# EAGLE design STM32_MACH3-Interfaceboard_V2 (EAGLE 7.7.0)
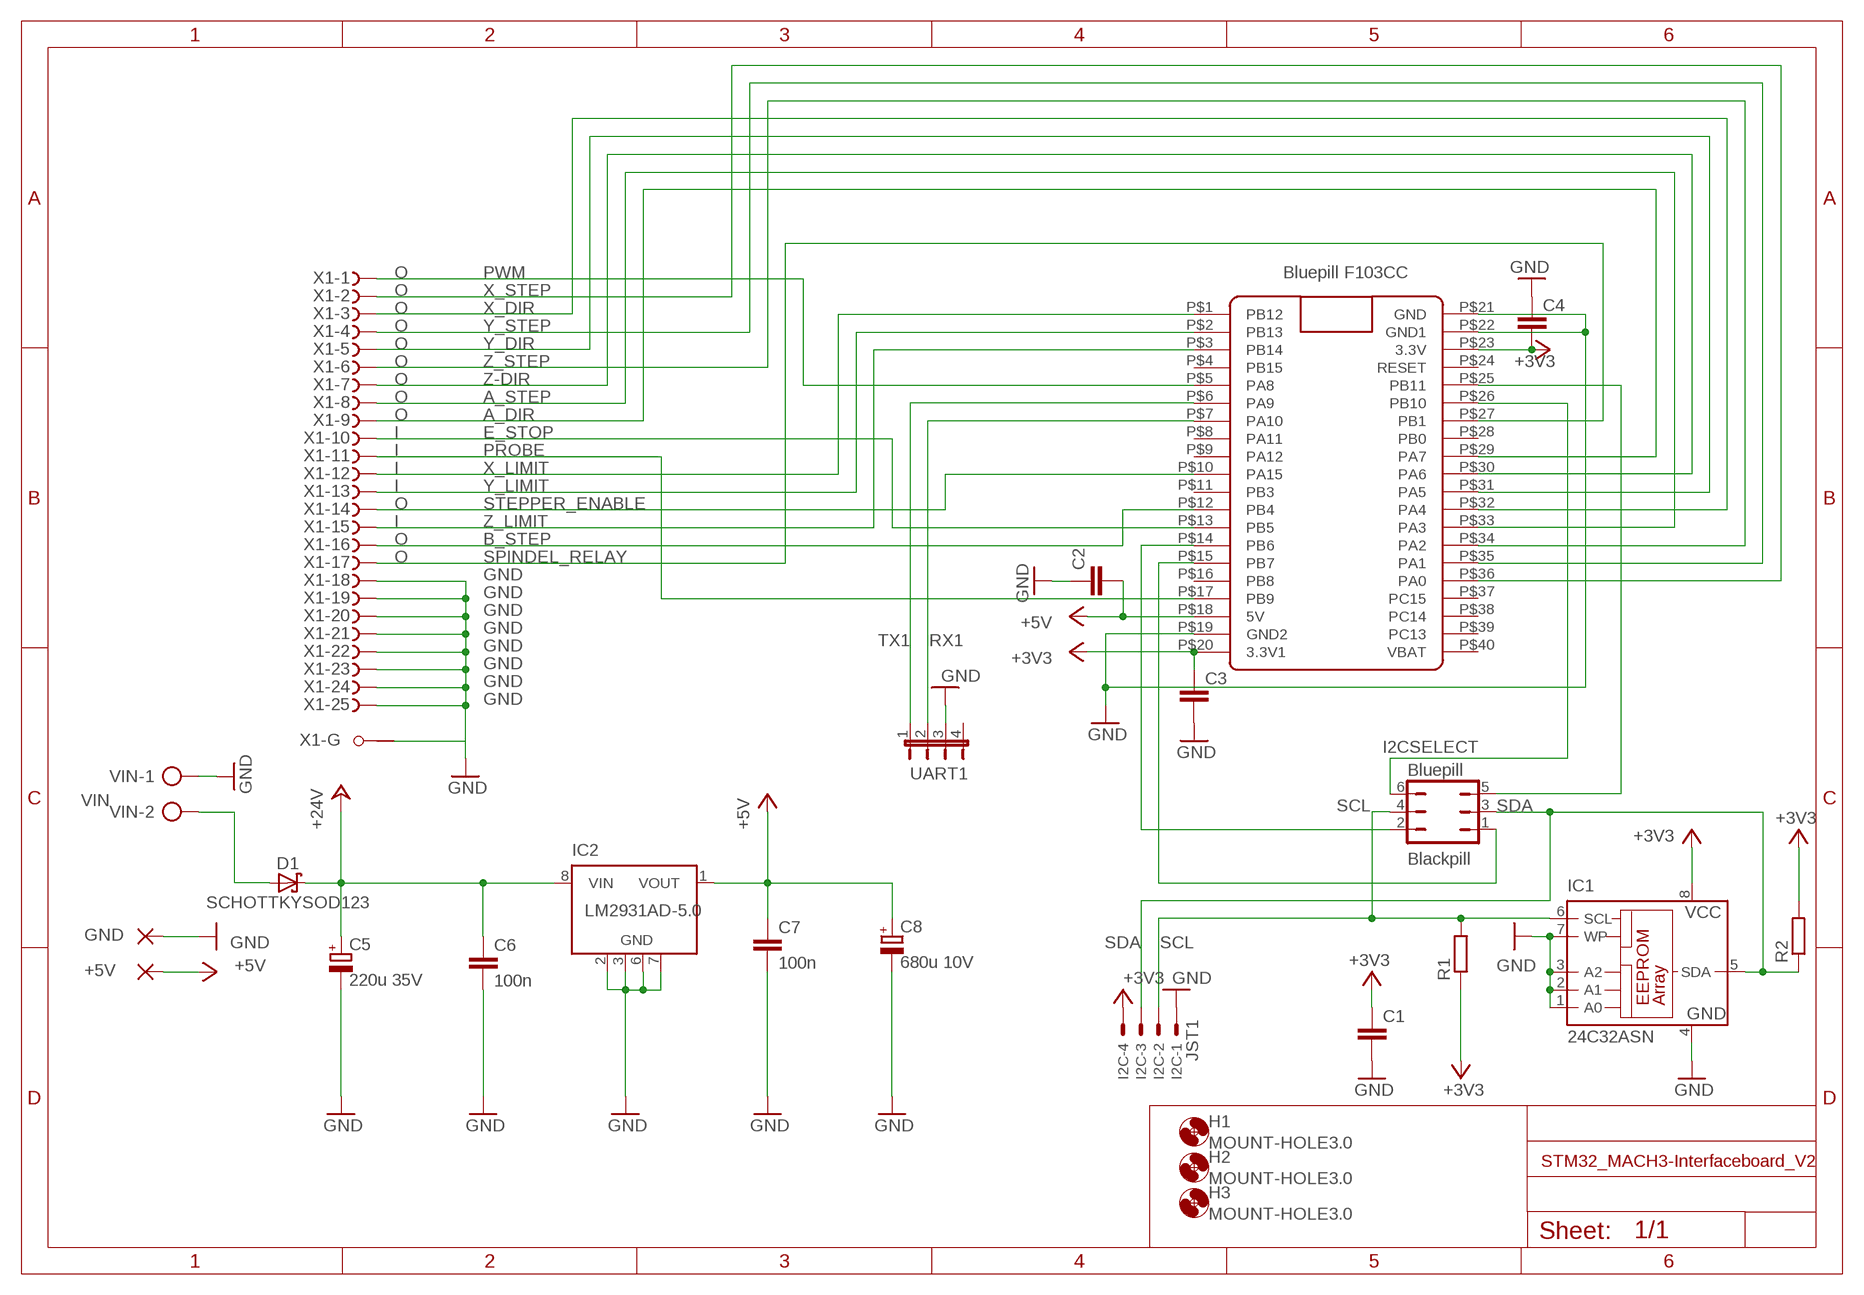
[diagram p0: schematic, sheet 1]

## Parts
+5V  2,54/1,0  [2,54/1,0]
C1  C-EUC0805  [C0805]
C2  C-EUC0805  [C0805]
C3  C-EUC0805  [C0805]
C4  C-EUC0805  [C0805]
C5  220u 35V  C_POLARIZEDE7  [PANASONIC_E7]
C6  100n  CC0805  [C0805]
C7  100n  CC0805  [C0805]
C8  680u 10V  C_POLARIZEDE7  [PANASONIC_E7]
D1  SCHOTTKYSOD123  [SOD123]
GND  2,54/1,0  [2,54/1,0]
H1  MOUNT-HOLE3.0  [3,0]
H2  MOUNT-HOLE3.0  [3,0]
H3  MOUNT-HOLE3.0  [3,0]
I2C  JST1  JST-XH-04-PIN-LONG-PAD  [JST-XH-04-PACKAGE-LONG-PAD]
I2CSELECT  JP3Q  [JP3Q]
IC1  24C32ASN  [SO-08]
IC2  LM2931AD-5.0  [SOIC8]
R1  R-EU_R0805  [R0805]
R2  R-EU_R0805  [R0805]
U$1  BLUE_PILL  [BLUE_PILL]
UART1  JP4E  [JP4]
VIN  AK500/2  [AK500/2]
X1  F25HPS  [F25HP]

## Nets
+3V3: C1.1 C3.1 C4.2 I2C.4 IC1.8(VCC) R1.1 R2.2 U$1.P$20(3.3V1) U$1.P$23(3.3V)
+5V: +5V.1(P) C2.2 C7.1 C8.+ IC2.1(VOUT) U$1.P$18(5V)
+24V: C5.+ C6.1 D1.C IC2.8(VIN)
A_DIR: U$1.P$29(PA7) X1.9(-9:F)
A_STEP: U$1.P$33(PA3) X1.8(-8:F)
B_STEP: U$1.P$12(PB4) X1.16(-16:F)
E_STOP: U$1.P$13(PB5) X1.10(-10:F)
GND: C1.2 C2.1 C3.2 C4.1 C5.- C6.2 C7.2 C8.- GND.1(P) I2C.1 IC1.1(A0) IC1.2(A1) IC1.3(A2) IC1.4(GND) IC1.7(WP) IC2.2(GND) IC2.3(GND) IC2.6(GND) IC2.7(GND) U$1.P$19(GND2) U$1.P$21(GND) U$1.P$22(GND1) UART1.3 VIN.1 X1.18(-18:F) X1.19(-19:F) X1.20(-20:F) X1.21(-21:F) X1.22(-22:F) X1.23(-23:F) X1.24(-24:F) X1.25(-25:F) X1.G1(-G:G1)
N$1: I2CSELECT.5 U$1.P$25(PB11)
N$2: I2CSELECT.6 U$1.P$26(PB10)
N$3: I2CSELECT.2 U$1.P$14(PB6)
N$4: I2CSELECT.1 U$1.P$15(PB7)
PROBE: U$1.P$17(PB9) X1.11(-11:F)
PWM: U$1.P$5(PA8) X1.1(-1:F)
RX1: U$1.P$7(PA10) UART1.2
SCL: I2C.2 I2CSELECT.4 IC1.6(SCL) R1.2
SDA: I2C.3 I2CSELECT.3 IC1.5(SDA) R2.1
SPINDEL_RELAY: U$1.P$27(PB1) X1.17(-17:F)
STEPPER_ENABLE: U$1.P$10(PA15) X1.14(-14:F)
TX1: U$1.P$6(PA9) UART1.1
VIN: D1.A VIN.2
X_DIR: U$1.P$32(PA4) X1.3(-3:F)
X_LIMIT: U$1.P$1(PB12) X1.12(-12:F)
X_STEP: U$1.P$36(PA0) X1.2(-2:F)
Y_DIR: U$1.P$31(PA5) X1.5(-5:F)
Y_LIMIT: U$1.P$2(PB13) X1.13(-13:F)
Y_STEP: U$1.P$35(PA1) X1.4(-4:F)
Z-DIR: U$1.P$30(PA6) X1.7(-7:F)
Z_LIMIT: U$1.P$3(PB14) X1.15(-15:F)
Z_STEP: U$1.P$34(PA2) X1.6(-6:F)
Unconnected: U$1.P$4(PB15) U$1.P$8(PA11) U$1.P$9(PA12) U$1.P$11(PB3) U$1.P$16(PB8) U$1.P$24(RESET) U$1.P$28(PB0) U$1.P$37(PC15) U$1.P$38(PC14) U$1.P$39(PC13) U$1.P$40(VBAT) UART1.4 X1.G2(-G:G2)

## Notes on the sheet
- O | Bluepill F103CC
- O
- O
- O
- O
- O
- O
- O
- O
- I
- I
- I
- I
- O
- I
- O
- O
- Bluepill
- Blackpill

## Library data of the parts
+5V GND = wirepad:2,54/1,0: THROUGH-HOLE PAD
C1-C4 = rcl:C-EU: CAPACITOR, European symbol
C5 C8 = 00Capacitor:C_POLARIZED
C6 C7 = 00Capacitor:C: Capacitor
D1 = 00Diode:SCHOTTKY
H1-H3 = holes:MOUNT-HOLE: MOUNTING HOLE with drill center marker
I2C = JST XH Connectors v1-0:JST-XH-04-PIN: JST XH Connector 2 Pin Wire to board connector. Pitch: 2,54 mm, (0.100") Number of pins: 4 Created by Rembrandt Electronics www.rembrandtelectronics.com
I2CSELECT = jumper:JP3Q: JUMPER
IC1 = microchip:24*: Serial EEPROM I2C; MPN: IS24C32A-2GLI; OC_FARNELL: 1224413; OC_NEWARK: 43M4588
IC2 = 00VoltageRegulator:LM2931*
R1 R2 = rcl:R-EU_: RESISTOR, European symbol
U$1 = BluePill:BLUE_PILL
UART1 = jumper:JP4E: JUMPER
VIN = con-ptr500:AK500/2: CONNECTOR; OC_FARNELL: unknown; OC_NEWARK: unknown
X1 = con-subd:F25HPS: SUB-D; OC_FARNELL: unknown; OC_NEWARK: unknown

## Board
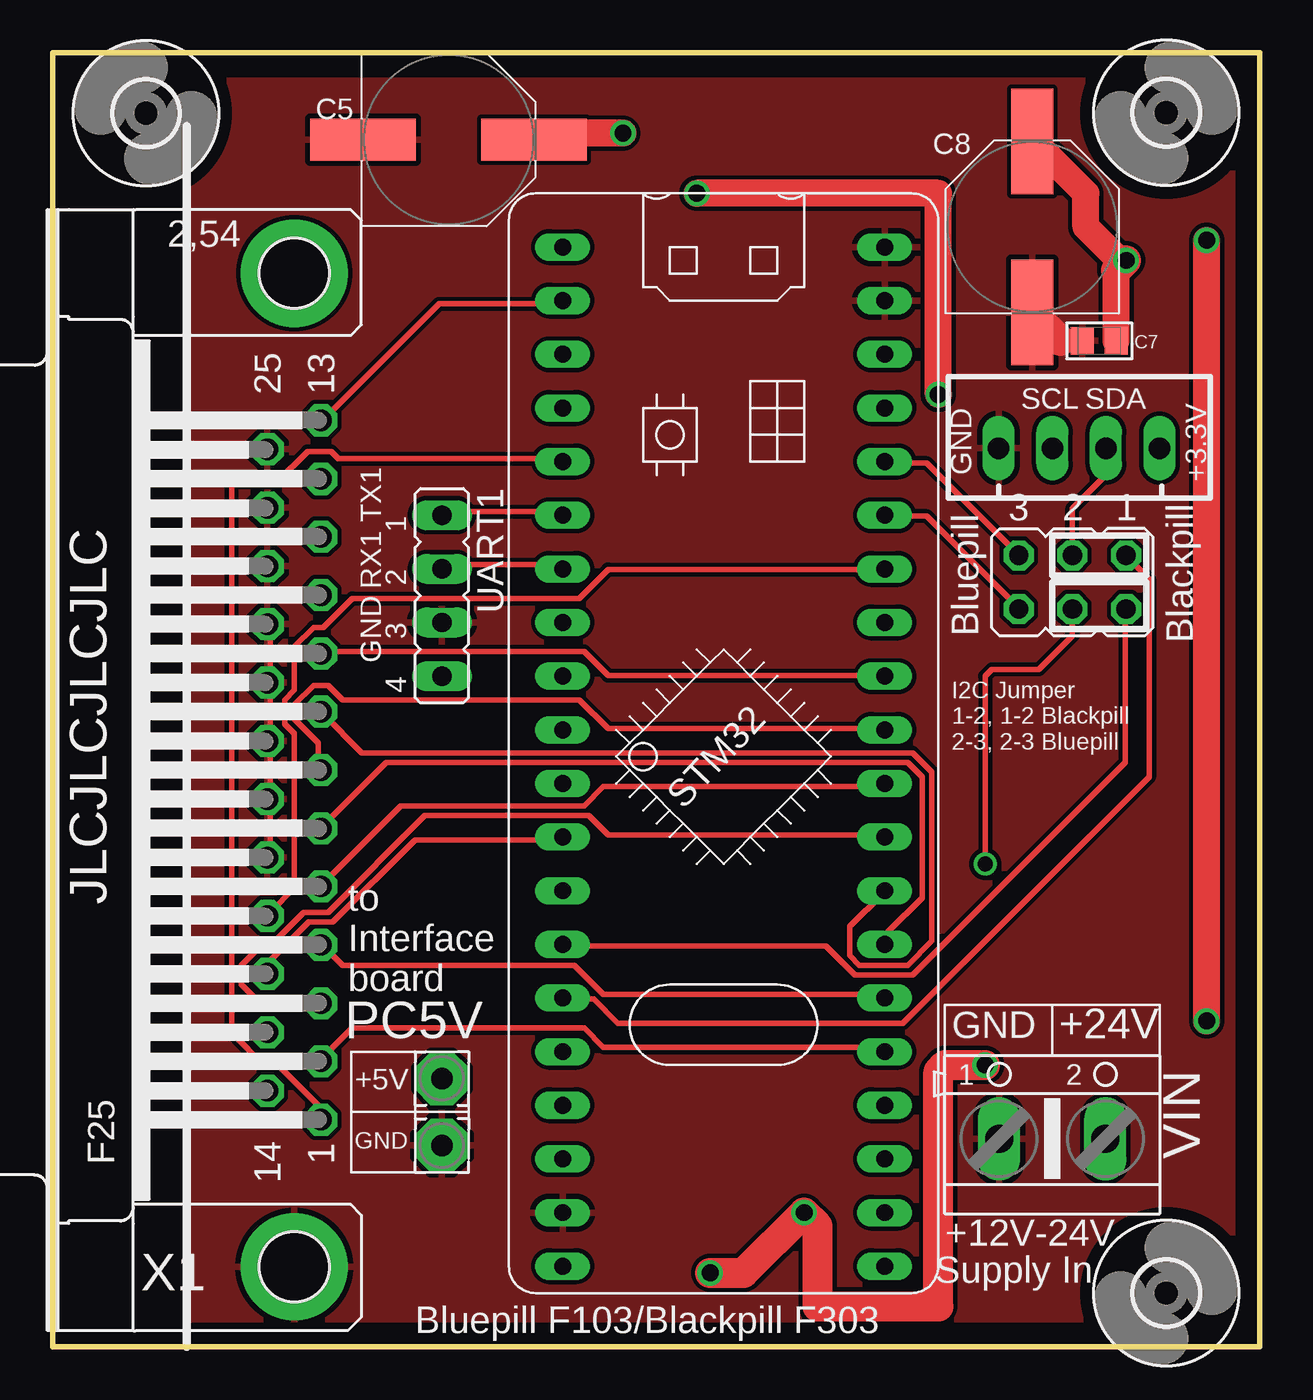
[diagram p1: board, top side]
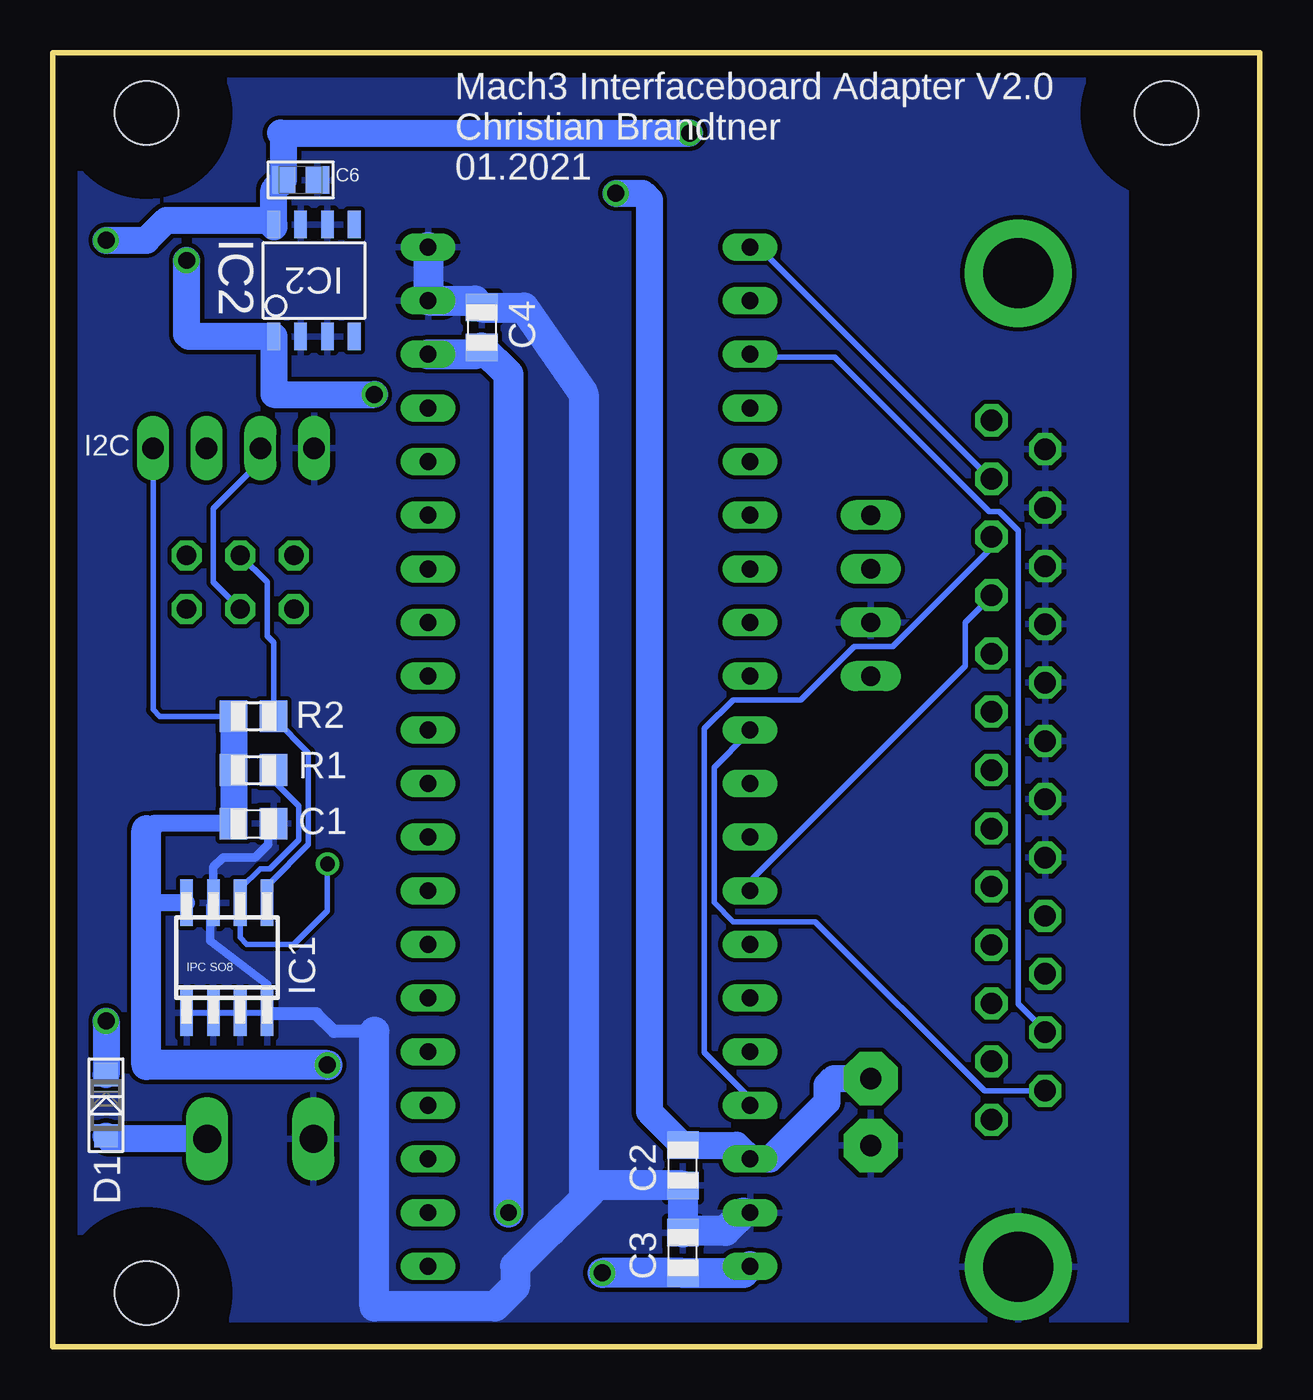
[diagram p2: board, bottom side, seen from below]

Size 57.13 x 61.27 mm. Coordinates in mm from the lower left corner, seen from the top.
Outline: 0,0 57.13,0 57.13,61.27 0,61.27 0,0
Copper layers (1*16): Top 0.035mm / dielectric 1.5mm / Bottom 0.035mm
Design rules "default": minimum track width 10mil, minimum drill 24mil, track to track 8mil, track to pad 8mil, pad to pad 8mil, via to via 8mil, smd to smd 8mil, copper to edge 40mil, drill to drill 8mil, minimum pad ring 10mil, minimum via ring 8mil, stop-mask expansion 4mil, vias tented up to drill 0mil, thermal gap 10mil

### Footprints (pad centres in the part's own frame; a part is rotated, then mirrored left to right if it is on the bottom)
2,54/1,0 = drill 1.016 pad 2.54 octagon: 1 0,0
C0805 = smd 1.3 x 1.5: 1 -0.95,0; 2 0.95,0
PANASONIC_E7 = smd 5 x 2: + 4.05,0; - -4.05,0
C0805' = smd 1.1 x 1.3: 1 -0.8,0; 2 0.8,0
SOD123 = smd 1.1 x 1.1: A 1.45,0; C -1.45,0
3,0 = hole 3: 0,0
JST-XH-04-PACKAGE-LONG-PAD = drill 1.016 long: 1 -3.81,0; 2 -1.27,0; 3 1.27,0; 4 3.81,0
JP3Q = drill 0.914 octagon: 1 -2.54,-1.27; 2 -2.54,1.27; 3 0,-1.27; 4 0,1.27; 5 2.54,-1.27; 6 2.54,1.27
SO-08 = smd 0.6 x 2.2: 1 -1.905,-2.6; 2 -0.635,-2.6; 3 0.635,-2.6; 4 1.905,-2.6; 5 1.905,2.6; 6 0.635,2.6; 7 -0.635,2.6; 8 -1.905,2.6
SOIC8 = smd 1.3 x 0.6: 1 -2.65,1.905; 2 -2.65,0.635; 3 -2.65,-0.635; 4 -2.65,-1.905; 5 2.65,-1.905; 6 2.65,-0.635; 7 2.65,0.635; 8 2.65,1.905
R0805 = smd 1.3 x 1.5: 1 -0.95,0; 2 0.95,0
BLUE_PILL = drill 0.8 long: P$1 -7.62,15.24; P$2 -7.62,12.7; P$3 -7.62,10.16; P$4 -7.62,7.62; P$5 -7.62,5.08; P$6 -7.62,2.54; P$7 -7.62,0; P$8 -7.62,-2.54; P$9 -7.62,-5.08; P$10 -7.62,-7.62; P$11 -7.62,-10.16; P$12 -7.62,-12.7; P$13 -7.62,-15.24; P$14 -7.62,-17.78; P$15 -7.62,-20.32; P$16 -7.62,-22.86; P$17 -7.62,-25.4; P$18 -7.62,-27.94; P$19 -7.62,-30.48; P$20 -7.62,-33.02; P$21 7.62,15.24; P$22 7.62,12.7; P$23 7.62,10.16; P$24 7.62,7.62; P$25 7.62,5.08; P$26 7.62,2.54; P$27 7.62,0; P$28 7.62,-2.54; P$29 7.62,-5.08; P$30 7.62,-7.62; P$31 7.62,-10.16; P$32 7.62,-12.7; P$33 7.62,-15.24; P$34 7.62,-17.78; P$35 7.62,-20.32; P$36 7.62,-22.86; P$37 7.62,-25.4; P$38 7.62,-27.94; P$39 7.62,-30.48; P$40 7.62,-33.02
JP4 = drill 0.914 long: 1 0,0; 2 2.54,0; 3 5.08,0; 4 7.62,0
AK500/2 = drill 1.321 long: 1 -2.515,0; 2 2.515,0
F25HP = drill 1.016 octagon: 1 -16.561,-1.27; 2 -13.792,-1.27; 3 -11.049,-1.27; 4 -8.28,-1.27; 5 -5.512,-1.27; 6 -2.769,-1.27; 7 0,-1.27; 8 2.769,-1.27; 9 5.512,-1.27; 10 8.28,-1.27; 11 11.049,-1.27; 12 13.792,-1.27; 13 16.561,-1.27; 14 -15.189,1.27; 15 -12.421,1.27; 16 -9.652,1.27; 17 -6.909,1.27; 18 -4.14,1.27; 19 -1.372,1.27; 20 1.372,1.27; 21 4.14,1.27; 22 6.909,1.27; 23 9.652,1.27; 24 12.421,1.27; 25 15.189,1.27 | drill 3.302 pad 5.08: G1 -23.52,0; G2 23.52,0

### Placement (x,y rotation side)
+5V  18.41,12.7 0 top
C1  47.62,24.77 0 bottom
C2  27.3,8.59 90 bottom
C3  27.3,4.45 90 bottom
C4  36.83,48.26 270 bottom
C5  18.73,57.15 0 top
C6  100n  [C0805']  45.4,55.24 0 bottom
C7  100n  [C0805']  49.53,47.62 180 top
C8  46.35,53.02 90 top
D1  54.61,11.43 270 bottom
GND  18.41,9.53 0 top
H1  52.7,58.42 0 top
H2  52.7,2.54 0 top
H3  4.41,58.41 90 top
I2C  48.58,42.55 0 top
I2CSELECT  48.26,36.2 180 top
IC1  48.9,18.41 0 bottom
IC2  44.77,50.48 90 bottom
R1  47.62,27.3 0 bottom
R2  47.62,29.84 180 bottom
U$1  31.75,36.83 0 top
UART1  18.41,39.37 270 top
VIN  47.31,9.84 0 top
X1  11.43,27.3 90 top

### Tracks (layer width: path | path; a pad name or v marks a point on that pad's centre or on a via)
+3V3  (via drill 0.8)
  Top 1.422: v44.13,13.34 42.23,13.34 41.91,13.02 41.91,1.91 36.2,1.91 36.2,5.71 v35.56,6.35 32.7,3.49 v31.11,3.49
  Bottom 0.254: I2C.4 52.39,30.16 52.07,29.84 R2.2
  Bottom 0.813: C1.1 52.39,24.77 52.7,24.45 | IC1.8 52.45,21.02 52.7,21.27
  Bottom 1.27: R2.2 R1.1 C1.1
  Bottom 1.422: v44.13,13.34 52.7,13.34 52.7,21.27 52.7,24.45 | U$1.P$20 24.45,3.5 C3.1 v31.11,3.5 v31.11,3.49 | U$1.P$23 37.15,46.99 C4.2 35.56,46.04 v35.56,6.35
+5V  (via drill 0.8)
  Top 1.27: v41.91,45.09 41.91,54.61 v30.48,54.61 | v50.8,51.44 50.48,51.44 48.9,53.02 48.9,54.61 46.43,57.07 C8.+ | C7.1 50.33,50.97
  Top 1.422: 50.33,50.97 v50.8,51.44
  Bottom 1.27: v50.8,51.44 50.8,47.94 50.69,47.83 IC2.1 46.67,45.09 v41.91,45.09 | v30.48,54.61 29.21,54.61 28.89,54.29 28.89,11.12 C2.2 24.77,9.54 U$1.P$18 23.18,8.89 20.48,11.59 20.48,12.38 20.16,12.7 +5V.1
+24V  (via drill 0.8)
  Top 1.27: v54.61,15.42 v54.61,52.39 | v26.99,57.47 23.1,57.47 C5.+
  Bottom 0.254: IC2.8 46.63,53.26 46.99,53.34
  Bottom 1.27: v54.61,52.39 52.7,52.39 51.75,53.34 46.99,53.34 46.67,53.02 | v26.99,57.47 46.35,57.47 46.2,57.31 C6.1 46.67,54.77 IC2.8 | v54.61,15.42 D1.C
A_DIR
  Top 0.254: U$1.P$29 39.32,31.77 26.29,31.77 25.15,32.92 12.8,32.92 X1.9
A_STEP
  Top 0.254: U$1.P$33 39.32,21.49 37.72,19.89 37.72,18.52 38.18,18.06 40.46,18.06 41.6,19.2 41.6,27.2 40.69,28.12 14.63,28.12 12.8,29.95 X1.8
B_STEP
  Top 0.254: U$1.P$12 24,24 17.14,24 13.26,20.12 12.12,20.12 10.29,18.29 10.29,17.83 X1.16
E_STOP
  Bottom 0.254: U$1.P$13 24,21.72 24,22.17 13.95,32.23 13.95,34.29 12.8,35.43 X1.10
GND
  Top 0.254: X1.18 10.29,23.32 10.29,25.83 X1.19 10.29,26.06 10.29,28.57 X1.20 10.29,28.8 10.29,31.32 X1.21 10.29,31.55 10.29,34.06 X1.22 10.29,34.29
  Top 1.016: C7.2 47.7,47.62
  Top 1.422: 47.7,47.62 C8.-
  Bottom 0.254: IC1.4 IC1.3 IC1.2 IC1.1
  Bottom 0.406: IC1.4 46.99,17.14 49.68,19.2 49.68,20.86 IC1.7 49.53,22.71 49.07,23.16 47.55,23.16 46.94,23.77 46.94,24.5 C1.2 | 32,45.11 32,36.88
  Bottom 0.61: 41.91,14.92 43.81,14.92 44.66,15.76 46.94,15.76 IC1.4
  Bottom 1.422: 24.43,6.35 25.3,5.49 27.21,5.49 C3.2 C2.1 31.38,7.63 32,7.01 | 32,7.01 33.53,5.49 33.57,5.49 35.24,3.81 35.24,2.86 36.2,1.91 41.91,1.91 41.91,14.92 | U$1.P$21 U$1.P$22 37.15,49.53 C4.1 34.83,49.21 32,45.11 32,7.01
  pour Top: 6.35,0.64 56.52,0.95 56.52,60.33 6.35,60.33
  pour Bottom: 6.35,60.33 56.52,60.33 56.52,0.95 6.35,0.64
N$1
  Top 0.254: U$1.P$25 39.55,41.83 41.38,41.83 45.72,37.49 I2CSELECT.5
N$2
  Top 0.254: U$1.P$26 39.55,39.32 41.38,39.32 45.72,34.98 I2CSELECT.6
N$3
  Top 0.254: U$1.P$14 24.23,18.97 36.58,18.97 37.95,17.6 40.69,17.6 50.75,27.66 50.75,34.75 I2CSELECT.2
N$4
  Top 0.254: U$1.P$15 24.23,16.46 25.6,16.46 26.75,15.32 40.23,15.32 51.89,26.98 51.89,36.35 50.98,37.26 I2CSELECT.1
PROBE
  Bottom 0.254: U$1.P$17 24.23,11.43 24.23,11.89 26.29,13.95 26.29,29.26 24.92,30.63 21.72,30.63 19.2,33.15 17.37,33.15 12.8,37.72 12.8,38.18 X1.11
PWM
  Top 0.254: U$1.P$5 24,42.06 13.49,42.06 13.48,42.07 13.18,42.39 12.06,42.39 10.61,40.93 8.46,40.93 8.46,14.86 10.06,13.26 10.74,13.26 12.57,11.43 12.57,10.74 X1.1
RX1
  Top 0.254: U$1.P$7 24,37.03 18.52,37.03 UART1.2
SCL  (via drill 0.7)
  Top 0.254: I2CSELECT.4 48.26,33.66 46.67,32.07 44.45,32.07 44.13,31.75 v44.13,22.86
  Bottom 0.254: R1.2 46.63,27.2 46.63,26.75 45.49,25.6 45.49,24 46.86,22.63 47.32,22.63 48.23,21.72 48.23,21.03 IC1.6 | 48.23,20.34 48.23,20.8 IC1.6 | I2C.2 47.31,41.91 49.53,39.69 49.53,36.2 I2CSELECT.4 | v44.13,22.86 44.13,20.64 45.72,19.05 47.94,19.05 48.26,19.37 IC1.6
SDA
  Top 0.254: I2CSELECT.3 48.26,39.69 49.85,41.27 I2C.3
  Bottom 0.254: IC1.5 46.86,21.03 46.86,21.95 45.03,23.77 45.03,28.12 46.63,29.72 R2.1 46.67,33.34 46.99,33.66 46.99,36.2 I2CSELECT.3
SPINDEL_RELAY
  Top 0.254: U$1.P$27 39.32,36.8 26.29,36.8 24.92,35.43 14.17,35.43 12.8,34.06 12.34,34.06 11.43,33.15 11.43,31.09 10.97,30.63 10.97,29.49 11.43,29.03 11.43,21.72 10.29,20.57 X1.17
STEPPER_ENABLE
  Bottom 0.254: X1.14 13.03,12.12 21.03,20.12 24.92,20.12 25.83,21.03 25.83,27.43 24.23,29.03 U$1.P$10
TX1
  Top 0.254: U$1.P$6 24,39.55 18.52,39.55 UART1.1
VIN
  Bottom 1.27: VIN.2 54.47,9.84 D1.A
X_DIR
  Top 0.254: U$1.P$32 39.32,24.23 26.29,24.23 25.38,25.15 17.6,25.15 13.03,20.57 11.89,20.57 10.06,18.75 9.6,18.75 8.91,18.06 8.91,17.14 9.6,16.46 12.57,16.46 X1.3
X_LIMIT
  Bottom 0.254: U$1.P$1 24,51.89 23.55,51.89 12.8,41.15 X1.12
X_STEP
  Top 0.254: U$1.P$36 39.32,14.17 26.06,14.17 25.15,15.09 14.17,15.09 12.8,13.72 X1.2
Y_DIR
  Top 0.254: U$1.P$31 39.32,26.52 26.06,26.52 25.15,25.6 16.46,25.6 12.8,21.95 X1.5
Y_LIMIT
  Top 0.254: U$1.P$2 24,49.38 18.29,49.38 12.8,43.89 X1.13
Y_STEP
  Top 0.254: U$1.P$35 39.32,16.69 26.06,16.69 24.69,18.06 13.72,18.06 12.8,18.97 X1.4
Z-DIR
  Top 0.254: U$1.P$30 39.32,29.26 26.29,29.26 24.92,30.63 13.72,30.63 13.03,31.32 12.34,31.32 11.43,30.4 11.43,29.72 12.57,28.57 12.57,27.43 X1.7
Z_LIMIT
  Bottom 0.254: U$1.P$3 24,46.86 20.12,46.86 12.8,39.55 12.34,39.55 11.43,38.63 11.43,16.23 10.29,15.09 X1.15
Z_STEP
  Top 0.254: U$1.P$34 39.55,19.2 39.55,19.66 41.15,21.26 41.15,26.98 40.46,27.66 15.77,27.66 12.8,24.69 X1.6

### Text on the board
tPlace: SCL | SDA | GND | +3.3V | TX1 | RX1 | Bluepill | Blackpill | GND | I2C Jumper / 1-2, 1-2 Blackpill / 2-3, 2-3 Bluepill | JLCJLCJLCJLC | to / Interface / board | +12V-24V | Bluepill F103/Blackpill F303
tNames: PC5V | GND | +24V | GND | Supply In
bNames: Mach3 Interfaceboard Adapter V2.0 / Christian Brandtner / 01.2021